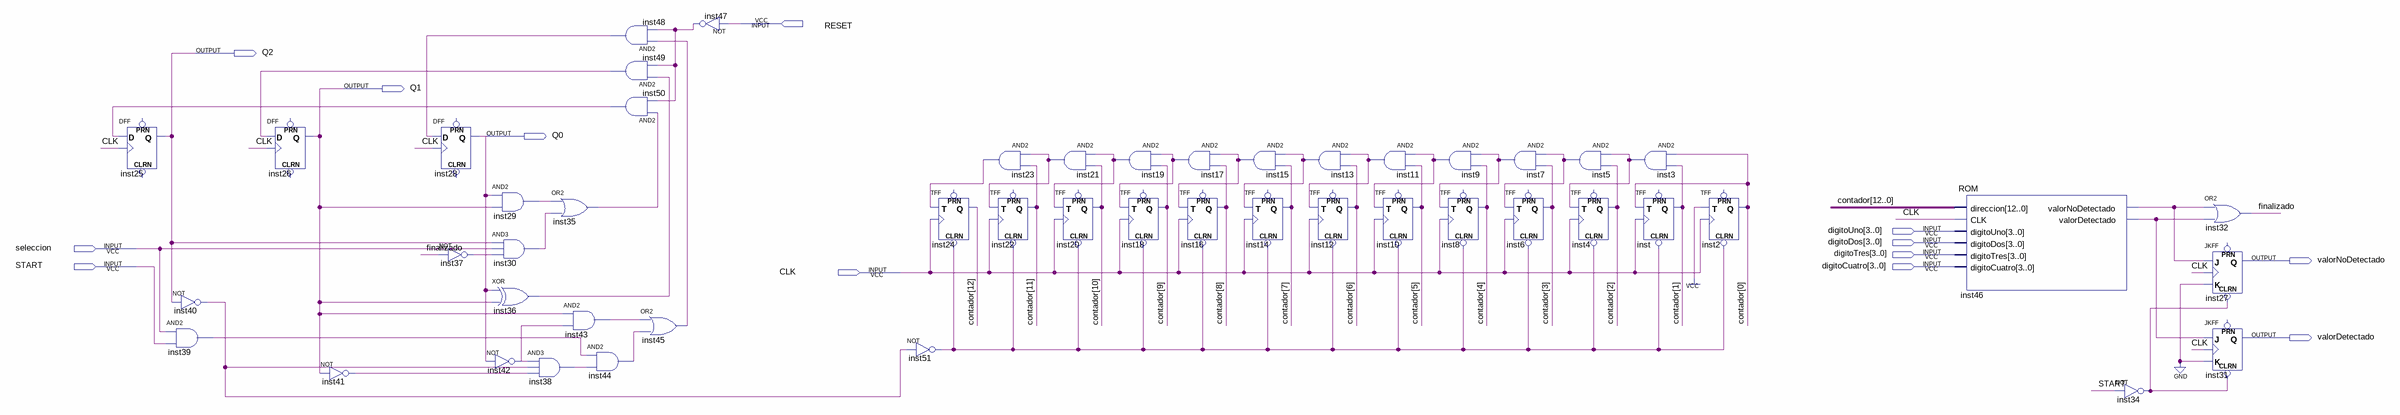
[diagram p0: schematic sheet]
// Quartus schematic procesoUno.bdf as structural Verilog: 50 symbols, 13 pins
module procesoUno (
  input  RESET,
  input  [3:0] digitoUno,
  input  [3:0] digitoDos,
  input  seleccion,
  input  [3:0] digitoTres,
  input  START,
  input  [3:0] digitoCuatro,
  input  CLK,
  output Q2,
  output Q1,
  output Q0,
  output valorNoDetectado,
  output valorDetectado
);

  wire finalizado, inst3_out, inst5_out, inst7_out, inst9_out, inst11_out, inst13_out, inst15_out,
       inst17_out, inst19_out, inst21_out, inst23_out, inst29_out, inst30_out, inst34_out, inst35_out,
       inst36_out, inst37_out, inst38_out, inst39_out, inst40_out, inst41_out, inst42_out, inst43_out,
       inst44_out, inst45_out, inst46_valordetectado, inst46_valornodetectado, inst47_out, inst48_out,
       inst49_out, inst50_out, inst51_out;
  wire [12:0] contador;

  DFF inst25 (.CLK(CLK), .D(inst50_out), .Q(Q2));  // open: CLRN, PRN
  not inst40 (inst40_out, Q2);
  and inst39 (inst39_out, seleccion, START);
  DFF inst26 (.CLK(CLK), .D(inst49_out), .Q(Q1));  // open: CLRN, PRN
  not inst41 (inst41_out, Q1);
  DFF inst28 (.CLK(CLK), .D(inst48_out), .Q(Q0));  // open: CLRN, PRN
  not inst37 (inst37_out, finalizado);
  and inst29 (inst29_out, Q0, Q1);
  and inst30 (inst30_out, Q2, seleccion, inst37_out);
  xor inst36 (inst36_out, Q0, Q1);
  and inst38 (inst38_out, inst42_out, inst40_out, inst41_out);
  not inst42 (inst42_out, Q0);
  or inst35 (inst35_out, inst29_out, inst30_out);
  and inst43 (inst43_out, Q1, inst42_out);
  and inst48 (inst48_out, inst45_out, inst47_out);
  and inst49 (inst49_out, inst36_out, inst47_out);
  and inst50 (inst50_out, inst35_out, inst47_out);
  and inst44 (inst44_out, inst39_out, inst38_out);
  or inst45 (inst45_out, inst43_out, inst44_out);
  not inst47 (inst47_out, RESET);
  not inst51 (inst51_out, inst40_out);
  TFF inst24 (.CLRN(inst51_out), .T(inst23_out), .CLK(CLK), .Q(contador[12]));  // open: PRN
  and inst23 (inst23_out, inst21_out, contador[11]);
  TFF inst22 (.CLRN(inst51_out), .T(inst21_out), .CLK(CLK), .Q(contador[11]));  // open: PRN
  and inst21 (inst21_out, inst19_out, contador[10]);
  TFF inst20 (.CLRN(inst51_out), .T(inst19_out), .CLK(CLK), .Q(contador[10]));  // open: PRN
  and inst19 (inst19_out, inst17_out, contador[9]);
  TFF inst18 (.CLRN(inst51_out), .T(inst17_out), .CLK(CLK), .Q(contador[9]));  // open: PRN
  and inst17 (inst17_out, inst15_out, contador[8]);
  TFF inst16 (.CLRN(inst51_out), .T(inst15_out), .CLK(CLK), .Q(contador[8]));  // open: PRN
  and inst15 (inst15_out, inst13_out, contador[7]);
  TFF inst14 (.CLRN(inst51_out), .T(inst13_out), .CLK(CLK), .Q(contador[7]));  // open: PRN
  and inst13 (inst13_out, inst11_out, contador[6]);
  TFF inst12 (.CLRN(inst51_out), .T(inst11_out), .CLK(CLK), .Q(contador[6]));  // open: PRN
  and inst11 (inst11_out, inst9_out, contador[5]);
  TFF inst10 (.CLRN(inst51_out), .T(inst9_out), .CLK(CLK), .Q(contador[5]));  // open: PRN
  and inst9 (inst9_out, inst7_out, contador[4]);
  TFF inst8 (.CLRN(inst51_out), .T(inst7_out), .CLK(CLK), .Q(contador[4]));  // open: PRN
  and inst7 (inst7_out, inst5_out, contador[3]);
  TFF inst6 (.CLRN(inst51_out), .T(inst5_out), .CLK(CLK), .Q(contador[3]));  // open: PRN
  and inst5 (inst5_out, inst3_out, contador[2]);
  TFF inst4 (.CLRN(inst51_out), .T(inst3_out), .CLK(CLK), .Q(contador[2]));  // open: PRN
  and inst3 (inst3_out, contador[0], contador[1]);
  TFF inst (.CLRN(inst51_out), .T(contador[0]), .CLK(CLK), .Q(contador[1]));  // open: PRN
  TFF inst2 (.CLRN(inst51_out), .T(1'b1), .CLK(CLK), .Q(contador[0]));  // open: PRN
  ROM inst46 (
    .direccion(contador), .CLK(CLK), .digitoUno(digitoUno), .digitoDos(digitoDos), .digitoTres(digitoTres),
    .digitoCuatro(digitoCuatro), .valorNoDetectado(inst46_valornodetectado),
    .valorDetectado(inst46_valordetectado));
  not inst34 (inst34_out, START);
  or inst32 (finalizado, inst46_valornodetectado, inst46_valordetectado);
  JKFF inst27 (.CLRN(inst34_out), .K(1'b0), .J(inst46_valornodetectado), .CLK(CLK), .Q(valorNoDetectado));  // open: PRN
  JKFF inst31 (.CLRN(inst34_out), .K(1'b0), .J(inst46_valordetectado), .CLK(CLK), .Q(valorDetectado));  // open: PRN
endmodule
